# Altium schematic sheet testy.SchDoc
size A4; SheetNumber: 5; SheetTotal: 5
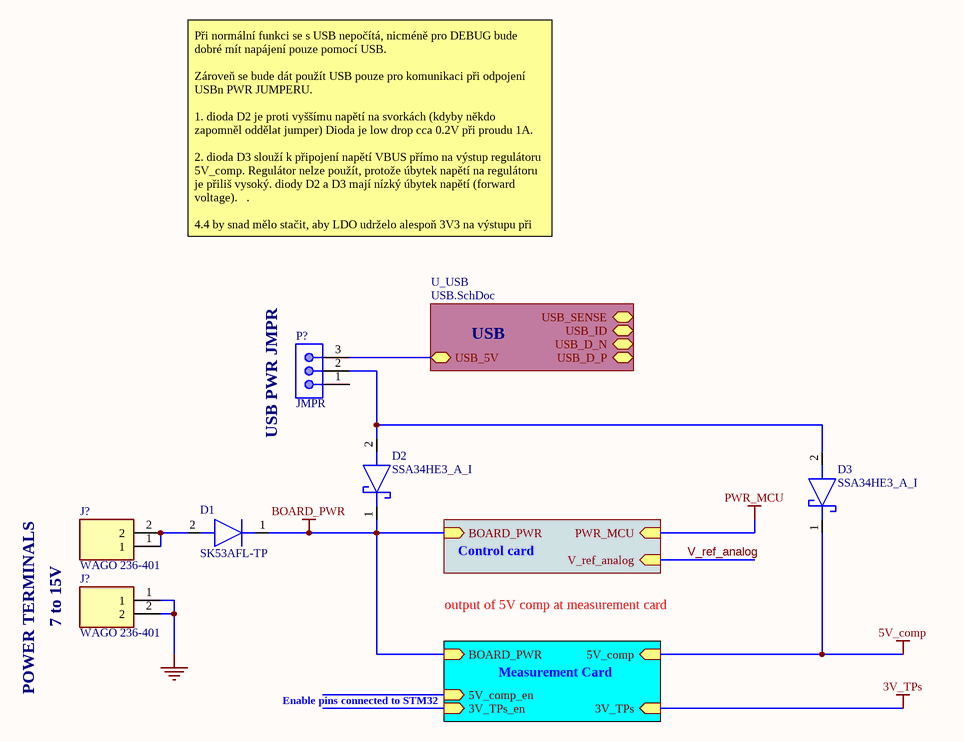
[diagram p0: testy.SchDoc]

## Parts
(Parts that share a designator on the sheet are numbered #1, #2 ... from top to bottom, then left to right.)
D1  SK53AFL-TP  [SODFL5026X120N]
D2  SSA34HE3_A_I  [DIONM5127X229N]
D3  SSA34HE3_A_I  [DIONM5127X229N]
J?#1  WAGO 236-401  [WAGO-236-601]
J?#2  WAGO 236-401  [WAGO-236-601]
P?  JMPR  [2.54mm header 3x1]

## Sub-sheets
U_POWER = POWER.SchDoc: PWR_MCU (in), BOARD_PWR (in), V_ref_analog (in)
U_POWER = POWER.SchDoc: 3V_TPs (in), BOARD_PWR (in), 5V_comp (in), 5V_comp_en (in), 3V_TPs_en (in)
U_USB = USB.SchDoc: USB_5V (bidir), USB_D_P (bidir), USB_D_N (bidir), USB_ID (bidir), USB_SENSE (bidir)

## Nets
3V_TPs: sheet U_POWER/3V_TPs
5V_comp: D3.1(K) ; sheet U_POWER/5V_comp
BOARD_PWR: D1.1(K) D2.1(K) ; sheet U_POWER/BOARD_PWR, sheet U_POWER/BOARD_PWR
GND: J?#2.1 J?#2.2
PWR_MCU: sheet U_POWER/PWR_MCU
V_ref_analog: sheet U_POWER/V_ref_analog
NetD1_2: D1.2(A) J?#1.1 J?#1.2
NetD2_2: D2.2(A) D3.2(A) P?.2
NetP?_3: P?.3 ; sheet U_USB/USB_5V

Not connected (* = marked no-connect by the designer): P? 1

## Notes on the sheet
- Při normální funkci se s USB nepočítá, nicméně pro DEBUG bude dobré mít napájení pouze pomocí USB.
  Zároveň se bude dát použít USB pouze pro komunikaci při odpojení
  USBn PWR JUMPERU.
  1. dioda D2 je proti vyššímu napětí na svorkách (kdyby někdo zapomněl oddělat jumper) Dioda je low drop cca 0.2V při proudu 1A.
  2. dioda D3 slouží k připojení napětí VBUS přímo na výstup regulátoru 5V_comp. Regulátor nelze použít, protože úbytek napětí na regulátoru je přiliš vysoký. diody D2 a D3 mají nízký úbytek napětí (forward voltage).   .
  4.4 by snad mělo stačit, aby LDO udrželo alespoň 3V3 na výstupu při 1A
- USB
- (near P?) USB PWR JMPR
- output of 5V comp at measurement card
- Control card
- 7 to 15V
- Measurement Card
- POWER TERMINALS
- Enable pins connected to STM32

## Library data of the parts
D1 = SK53AFL-TP: Diode; Manufacturer_Name: Micro Commercial Components (MCC); Datasheet Link: https://componentsearchengine.com/Datasheets/1/SK53AFL-TP.pdf; Height: 1.2mm; Manufacturer_Part_Number: SK53AFL-TP; Mouser Part Number: 833-SK53AFL-TP; Mouser Price/Stock: https://www.mouser.co.uk/ProductDetail/Micro-Commercial-Components-MCC/SK53AFL-TP?qs=T3oQrply3y%2F%2FTb8lb%252B6EMA%3D%3D; Arrow Part Number: SK53AFL-TP; Arrow Price/Stock: https://www.arrow.com/en/products/sk53afl-tp/micro-commercial-components?region=nac
D2 D3 = SSA34HE3_A_I: Schottky Diode; Manufacturer_Name: Vishay; Manufacturer_Part_Number: SSA34HE3_A/I; Datasheet Link: https://componentsearchengine.com/Datasheets/1/SSA34HE3_A_I.pdf; Height: 2.29mm; Mouser Part Number: 78-SSA34HE3_A/I; Mouser Price/Stock: https://www.mouser.co.uk/ProductDetail/Vishay-General-Semiconductor/SSA34HE3_A-I?qs=asPD7ZL2j3VimMFbwwU%2FoA%3D%3D; Arrow Part Number: SSA34HE3_A/I; Arrow Price/Stock: https://www.arrow.com/en/products/ssa34he3-ai/vishay?region=nac
J?#1 J?#2 = WAGO 236-401: Connector; Datasheet Link: https://componentsearchengine.com/Datasheets/2/236-401.pdf; Height: 13mm; Manufacturer_Name: Wago; Manufacturer_Part_Number: 236-401; Arrow Part Number: 236-401; Arrow Price/Stock: https://www.arrow.com/en/products/236-401/wago-kontakttechnik-gmbh
P? = 3x1 Header: Male Header, Pitch 2.54 mm, 1 x 3 Position, Height 8.21 mm, Tail Length 3.05 mm, -65 to 105 degC, RoHS, Bulk; Manufacturer: TE Connectivity; Mating Connector Lock: No(Without); Number of Positions: 2; Pitch: 2.54mm; PCB Mounting Orientation: Vertical; Keyed: No; Case\/Package: 100; Mating Post Length: 0.23inch; High Temperature Housing: Yes; Max Current Rating: 5A; PCB Thickness: 0.063inch; PCB Mount Retention: Without; Approvals: CSA; Current Rating: 3A; Radiation Hardening: No; Length: 4.67mm; Contact Mating Length: 0.23inch; Connector Type: Header; Number of Rows: 1; Termination Post Length: 0.12inch; Board Standoff: No(Without); Max Operating Temperature: 105degC; Contact Shape: Square; Selectively Loaded: No(Without); Gasket: No(Without); Number of Contacts: 2; Contact Gender: Male; Mating Alignment: No(Without); Manufacturer URL: http://www.te.com/; Datasheet URL: http://www.te.com/commerce/DocumentDelivery/DDEController?Action=showdoc&DocId=Customer+Drawing%7F146280%7FH1%7Fpdf%7FEnglish%7FENG_CD_146280_H1.pdf%7F5-146280-2; Mount: ThroughHole; Orientation: Straight; Packaging: Carton; Package Reference: 5-146280-2; Package Quantity: 500; Stabilizers: No(Without); Row Spacing: 2.54mm; Contact Material: CopperAlloy; Panel Mount Retention: No(Without); Datasheet Version: Rev. H1, 08/2016; Housing Colour: Black; Colour: Black; Package Description: Male Header, Pitch 2.54 mm, 1 x 2 Position, Height 8.21 mm, Tail Length 3.05 mm; Contact Plating: Matte; Housing Material: Polymer; Contact Protection: No(Without); Min Operating Temperature: -65degC; Mounting Technology: ThroughHole; Flammability Rating: UL94V-0; RoHSCompliant: true; Termination: ThroughHole; Depth: 2.34mm; High Speed Serial Data Connector: No